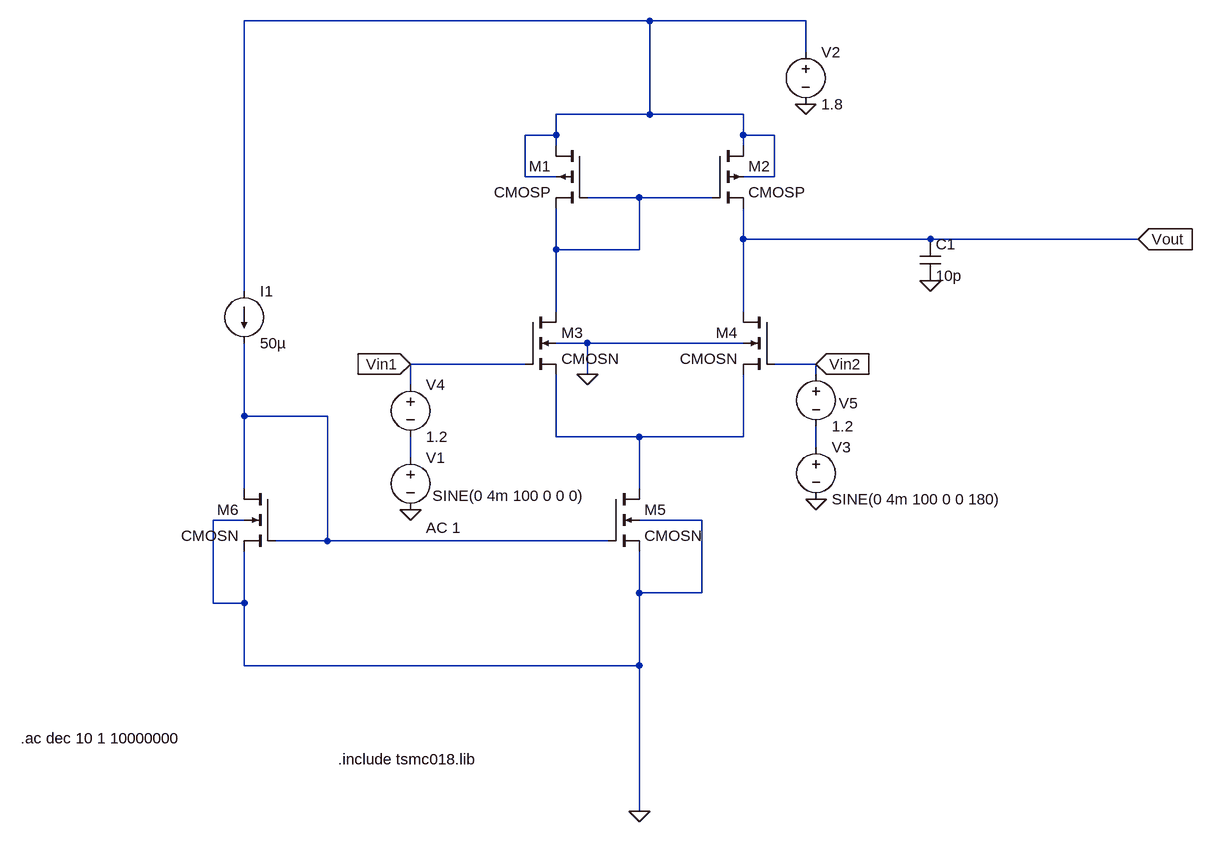
[diagram p0: schematic Single Stage OTA.asc]
Single Stage OTA.asc, the LTspice schematic file:
Version 4
SHEET 1 4532 1640
WIRE 1648 -224 1024 -224
WIRE 1888 -224 1648 -224
WIRE 1888 -176 1888 -224
WIRE 1648 -80 1648 -224
WIRE 1648 -80 1504 -80
WIRE 1792 -80 1648 -80
WIRE 1504 -48 1504 -80
WIRE 1504 -48 1456 -48
WIRE 1792 -48 1792 -80
WIRE 1840 -48 1792 -48
WIRE 1504 -32 1504 -48
WIRE 1792 -32 1792 -48
WIRE 1456 16 1456 -48
WIRE 1504 16 1456 16
WIRE 1840 16 1840 -48
WIRE 1840 16 1792 16
WIRE 1632 48 1552 48
WIRE 1744 48 1632 48
WIRE 1792 112 1792 64
WIRE 2080 112 1792 112
WIRE 2400 112 2080 112
WIRE 1504 128 1504 64
WIRE 1632 128 1632 48
WIRE 1632 128 1504 128
WIRE 1024 192 1024 -224
WIRE 1504 224 1504 128
WIRE 1792 224 1792 112
WIRE 1552 272 1504 272
WIRE 1792 272 1552 272
WIRE 1456 304 1280 304
WIRE 1904 304 1840 304
WIRE 1552 320 1552 272
WIRE 1904 320 1904 304
WIRE 1280 336 1280 304
WIRE 1024 384 1024 272
WIRE 1152 384 1024 384
WIRE 1504 416 1504 320
WIRE 1632 416 1504 416
WIRE 1792 416 1792 320
WIRE 1792 416 1632 416
WIRE 1904 432 1904 400
WIRE 1280 448 1280 416
WIRE 1024 496 1024 384
WIRE 1632 496 1632 416
WIRE 1024 544 976 544
WIRE 1728 544 1632 544
WIRE 1152 576 1152 384
WIRE 1152 576 1072 576
WIRE 1584 576 1152 576
WIRE 1632 656 1632 592
WIRE 1728 656 1728 544
WIRE 1728 656 1632 656
WIRE 976 672 976 544
WIRE 1024 672 1024 592
WIRE 1024 672 976 672
WIRE 1024 768 1024 672
WIRE 1632 768 1632 656
WIRE 1632 768 1024 768
WIRE 1632 992 1632 768
FLAG 1552 320 0
FLAG 2400 112 Vout
IOPIN 2400 112 In
FLAG 1632 992 0
FLAG 1888 -96 0
FLAG 2080 176 0
FLAG 1904 512 0
FLAG 1280 304 Vin1
IOPIN 1280 304 In
FLAG 1904 304 Vin2
IOPIN 1904 304 In
FLAG 1280 528 0
SYMBOL pmos4 1552 -32 M0
SYMATTR InstName M1
SYMATTR Value2 l=1u w=42u
SYMATTR Value CMOSP
SYMBOL pmos4 1744 -32 R0
SYMATTR InstName M2
SYMATTR Value2 l=1u w=42u
SYMATTR Value CMOSP
SYMBOL nmos4 1456 224 R0
SYMATTR InstName M3
SYMATTR Value2 l=1u w=9u
SYMATTR Value CMOSN
SYMBOL nmos4 1840 224 M0
SYMATTR InstName M4
SYMATTR Value2 l=1u w=9u
SYMATTR Value CMOSN
SYMBOL nmos4 1584 496 R0
SYMATTR InstName M5
SYMATTR Value2 l=1u w=6u
SYMATTR Value CMOSN
SYMBOL nmos4 1072 496 M0
SYMATTR InstName M6
SYMATTR Value2 l=1u w=6u
SYMATTR Value CMOSN
SYMBOL voltage 1280 432 R0
WINDOW 3 34 75 Left 2
WINDOW 123 24 124 Left 2
WINDOW 39 0 0 Left 0
SYMATTR Value SINE(0 4m 100 0 0 0)
SYMATTR Value2 AC 1
SYMATTR InstName V1
SYMBOL voltage 1888 -192 R0
SYMATTR InstName V2
SYMATTR Value 1.8
SYMBOL current 1024 192 R0
SYMATTR InstName I1
SYMATTR Value 50µ
SYMBOL cap 2064 112 R0
SYMATTR InstName C1
SYMATTR Value 10p
SYMBOL voltage 1904 416 R0
WINDOW 123 0 0 Left 0
WINDOW 39 0 0 Left 0
SYMATTR InstName V3
SYMATTR Value SINE(0 4m 100 0 0 180)
SYMBOL voltage 1280 320 R0
WINDOW 123 0 0 Left 0
WINDOW 39 0 0 Left 0
SYMATTR InstName V4
SYMATTR Value 1.2
SYMBOL voltage 1904 304 R0
WINDOW 123 0 0 Left 0
WINDOW 39 0 0 Left 0
WINDOW 0 35 60 Left 2
SYMATTR InstName V5
SYMATTR Value 1.2
TEXT 680 880 Left 2 !.ac dec 10 1 10000000
TEXT 1168 912 Left 2 !.include tsmc018.lib

The netlist it stands for:
* Single Stage OTA.asc
M1 N001 N002 N002 N001 CMOSP l=1u w=42u
M2 N001 N002 Vout N001 CMOSP l=1u w=42u
M3 N002 Vin1 N004 0 CMOSN l=1u w=9u
M4 Vout Vin2 N004 0 CMOSN l=1u w=9u
M5 N004 N003 0 0 CMOSN l=1u w=6u
M6 N003 N003 0 0 CMOSN l=1u w=6u
V1 N006 0 SINE(0 4m 100 0 0 0) AC 1
V2 N001 0 1.8
I1 N001 N003 50µ
C1 Vout 0 10p
V3 N005 0 SINE(0 4m 100 0 0 180)
V4 Vin1 N006 1.2
V5 Vin2 N005 1.2
.model NMOS NMOS
.model PMOS PMOS
.lib standard.mos
.ac dec 10 1 10000000
.include tsmc018.lib
.backanno
.end